# EAGLE design stLink-cortex_adapter (EAGLE 6.5.0)
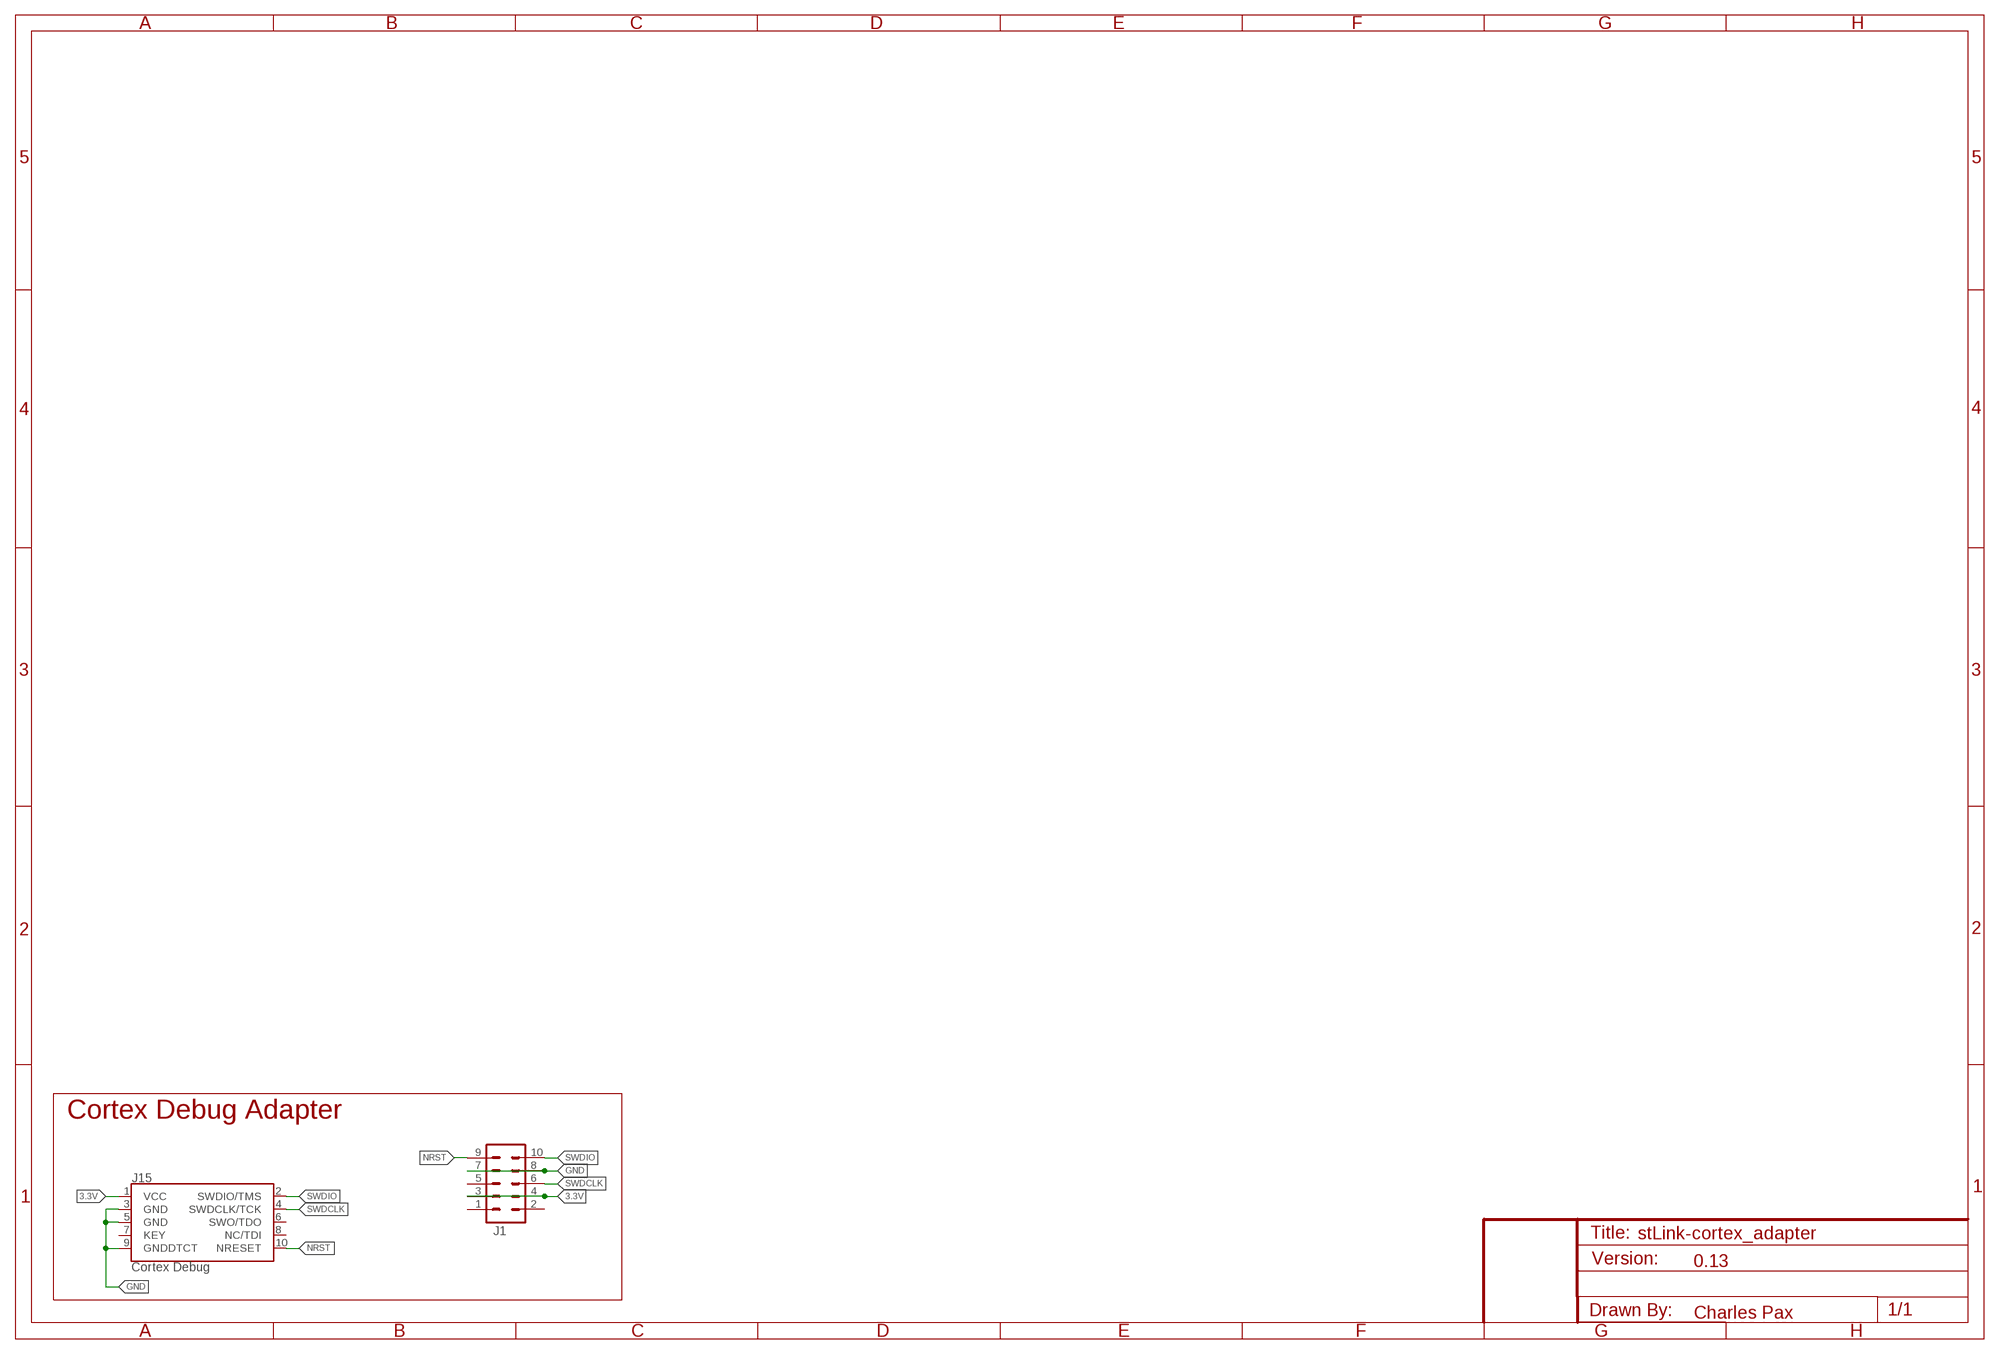
[diagram p0: schematic, sheet 1]

## Parts
J1  M05X2SHD_SMD  [2X5-SHROUDED_SMD]
J15  Cortex Debug  CORTEX_DEBUGSMD  [SAMTECH_FTSH-105-01]

## Nets
3.3V: J1.3 J1.4 J15.1(VCC)
GND [Ground]: J1.7 J1.8 J15.3(GND) J15.5(GND) J15.9(GNDDTCT)
NRST: J1.9 J15.10(NRESET)
SWDCLK: J1.6 J15.4(SWDCLK/TCK)
SWDIO: J1.10 J15.2(SWDIO/TMS)
Unconnected: J1.1 J1.2 J1.5 J15.6(SWO/TDO) J15.7(KEY) J15.8(NC/TDI)

## Notes on the sheet
- Cortex Debug Adapter
- 0.13
- Charles Pax

## Library data of the parts
J1 = SparkFun-Connectors:M05X2: Header 5x2 Standard 10-pin dual row 0.1" header. Commonly used with AVR-ISP. Use with Spark Fun Electronics SKU: PRT-00778
J15 = SparkFun-Connectors:CORTEX_DEBUG: Cortex Debug Connector Datasheet <http://infocenter.arm.com/help/topic/com.arm.doc.faqs/attached/13634/cortex_debug_connectors.pdf>

## Net classes
0 Digital signal: width 0.075 mm, drill 0.2 mm, clearance 0.075 mm
1 3.3V power: width 0.075 mm, drill 0.2 mm, clearance 0.075 mm
2 RTC battery: width 0.075 mm, drill 0.2 mm, clearance 0.075 mm
3 5V power: width 0.075 mm, drill 0.2 mm, clearance 0.075 mm
4 Analog signal: width 0.075 mm, drill 0.2 mm, clearance 0.075 mm
5 Ground: width 0.075 mm, drill 0.2 mm, clearance 0.075 mm

## Board
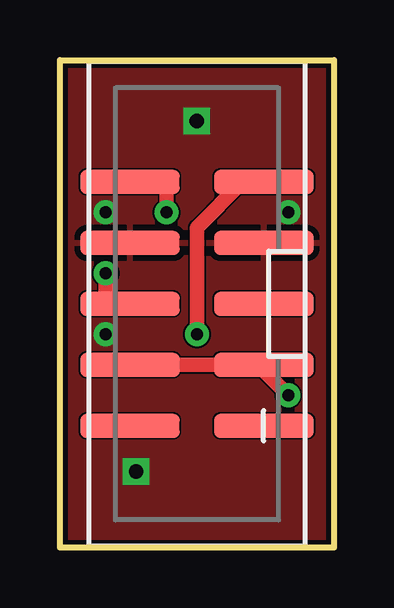
[diagram p1: board, top side]
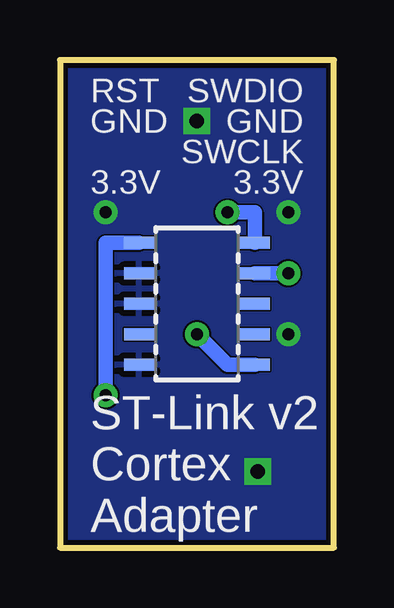
[diagram p2: board, bottom side, seen from below]

Size 11.43 x 20.32 mm. Coordinates in mm from the lower left corner, seen from the top.
Outline: 0,0 0,20.32 11.43,20.32 11.43,0 0,0
Copper layers (1*2+15*16): Top 0.017mm / dielectric 0.5mm / GND 0.017mm / dielectric 0.075mm / 3.3V 0.017mm / dielectric 0.5mm / Bottom 0.017mm
Design rules "PaxInstrument-T400 *": minimum track width 0.1mm, minimum drill 0.2mm, track to track 0.075mm, track to pad 0.075mm, pad to pad 0.075mm, via to via 0.075mm, smd to smd 0.075mm, copper to edge 0.2mm, drill to drill 0.2mm, minimum pad ring 12mil, minimum via ring 10mil, stop-mask expansion 0.05mm, vias tented up to drill 0.2mm, thermal gap 10mil

### Footprints (pad centres in the part's own frame; a part is rotated, then mirrored left to right if it is on the bottom)
2X5-SHROUDED_SMD = smd 4.15 x 1: 1 -2.794,5.08; 2 2.794,5.08; 3 -2.794,2.54; 4 2.794,2.54; 5 -2.794,0; 6 2.794,0; 7 -2.794,-2.54; 8 2.794,-2.54; 9 -2.794,-5.08; 10 2.794,-5.08
SAMTECH_FTSH-105-01 = smd 0.508 x 1.27: 1 -2.54,-2.413; 2 -2.54,2.413; 3 -1.27,-2.413; 4 -1.27,2.413; 5 0,-2.413; 6 0,2.413; 7 1.27,-2.413; 8 1.27,2.413; 9 2.54,-2.413; 10 2.54,2.413

### Placement (x,y rotation side)
J1  5.71,10.16 180 top
J15  5.71,10.16 270 bottom

### Tracks (layer width: path | path; a pad name or v marks a point on that pad's centre or on a via)
3.3V  (via drill 0.5)
  Top 0.61: J1.4 J1.3 8.51,7.37 v9.53,6.35
  Bottom 0.61: v9.53,6.35 9.53,12.7 J15.1
GND  (via drill 0.5, 0.6)
  other vias: 3.17,3.17 5.71,17.78 9.53,13.97 1.91,13.97 1.91,8.89
  pour Top: 0,0 11.43,0 11.43,20.32 0,20.32
  pour Bottom: 0,0 11.43,0 11.43,20.32 0,20.32
NRST  (via drill 0.5)
  Top 0.61: J1.9 7.62,15.24 5.71,13.34 v5.71,8.89
  Bottom 0.61: v5.71,8.89 4.45,7.62 J15.10
SWDCLK  (via drill 0.5)
  Top 0.61: v1.91,11.43 1.91,10.16 J1.6
  Bottom 0.61: J15.4 v1.91,11.43
SWDIO  (via drill 0.5)
  Top 0.61: J1.10 4.45,15.24 v4.45,13.97
  Bottom 0.61: v4.45,13.97 3.3,13.97 J15.2

### Text on the board
bPlace: SWDIO | RST | GND | GND | SWCLK | 3.3V | 3.3V | ST-Link v2 / Cortex / Adapter
tDocu: SWDIO | RST | GND | GND | SWCLK | 3.3V | 3.3V